# Altium schematic sheet TCA9406DCUR.SchDoc
size A; SheetNumber: 1; SheetTotal: 1
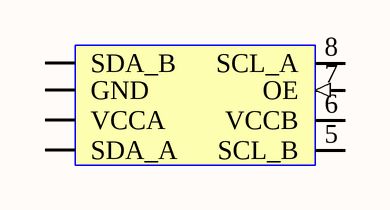
[diagram p0: TCA9406DCUR.SchDoc]

## Parts
U?  TCA9406DCUR  [TSSOP50P300X110-8N]  (value not drawn)

## Nets

Not connected (* = marked no-connect by the designer): U? 1(SDA_B) 2(GND) 3(VCCA) 4(SDA_A) 5(SCL_B) 6(VCCB) 7(OE) 8(SCL_A)

## Library data of the parts
U? = TCA9406DCUR: 2-Bit Bidirectional I2C Voltage-Level Translator, VSSOP-8; Manufacturer: Texas Instruments; VCCA: 1.65V to 3.6V; VCCB: 2.3V to 5.5V; MPN: TCA9406DCUR; Package: VSSOP-8